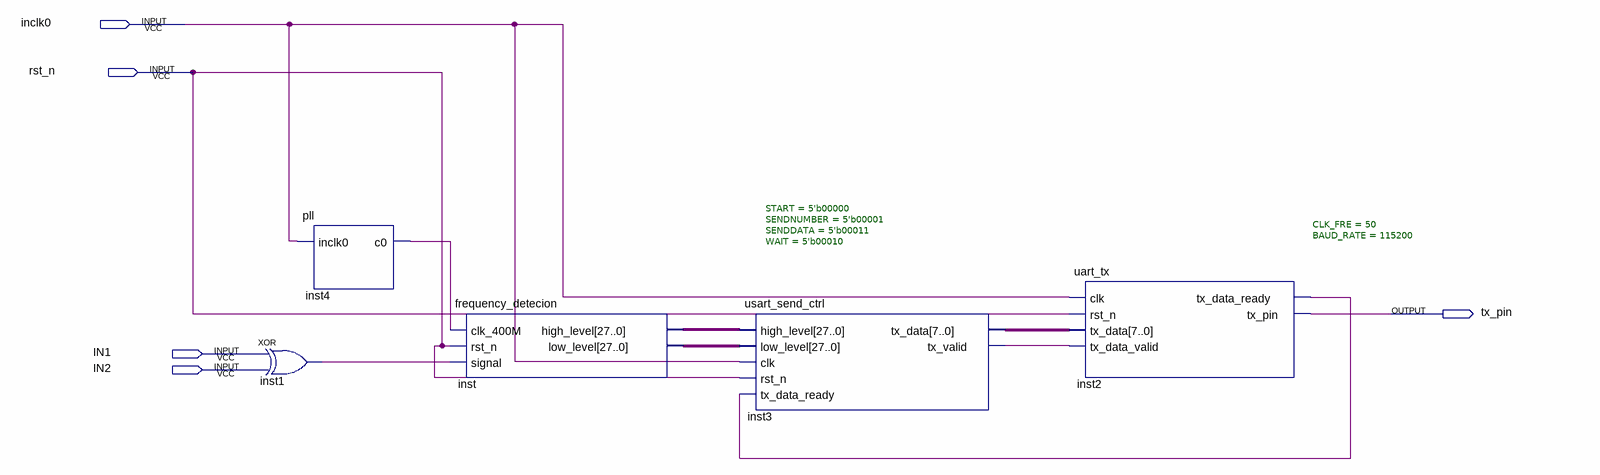
[diagram p0: schematic sheet]
// Quartus schematic fpga_top.bdf as structural Verilog: 5 symbols, 5 pins
module fpga_top (
  input  inclk0,
  input  rst_n,
  input  IN1,
  input  IN2,
  output tx_pin
);

  wire inst1_out, inst2_tx_data_ready, inst3_tx_valid, inst4_c0;
  wire [7:0] inst3_tx_data;
  wire [27:0] inst_high_level, inst_low_level;

  xor inst1 (inst1_out, IN1, IN2);
  pll inst4 (.inclk0(inclk0), .c0(inst4_c0));
  frequency_detecion inst (
    .clk_400M(inst4_c0), .rst_n(rst_n), .signal(inst1_out), .high_level(inst_high_level),
    .low_level(inst_low_level));
  usart_send_ctrl #(.START(5'b00000), .SENDNUMBER(5'b00001), .SENDDATA(5'b00011), .WAIT(5'b00010)) inst3 (
    .high_level(inst_high_level), .low_level(inst_low_level), .clk(inclk0), .rst_n(rst_n),
    .tx_data_ready(inst2_tx_data_ready), .tx_data(inst3_tx_data), .tx_valid(inst3_tx_valid));
  uart_tx #(.CLK_FRE(50), .BAUD_RATE(115200)) inst2 (
    .clk(inclk0), .rst_n(rst_n), .tx_data(inst3_tx_data), .tx_data_valid(inst3_tx_valid),
    .tx_data_ready(inst2_tx_data_ready), .tx_pin(tx_pin));
endmodule
